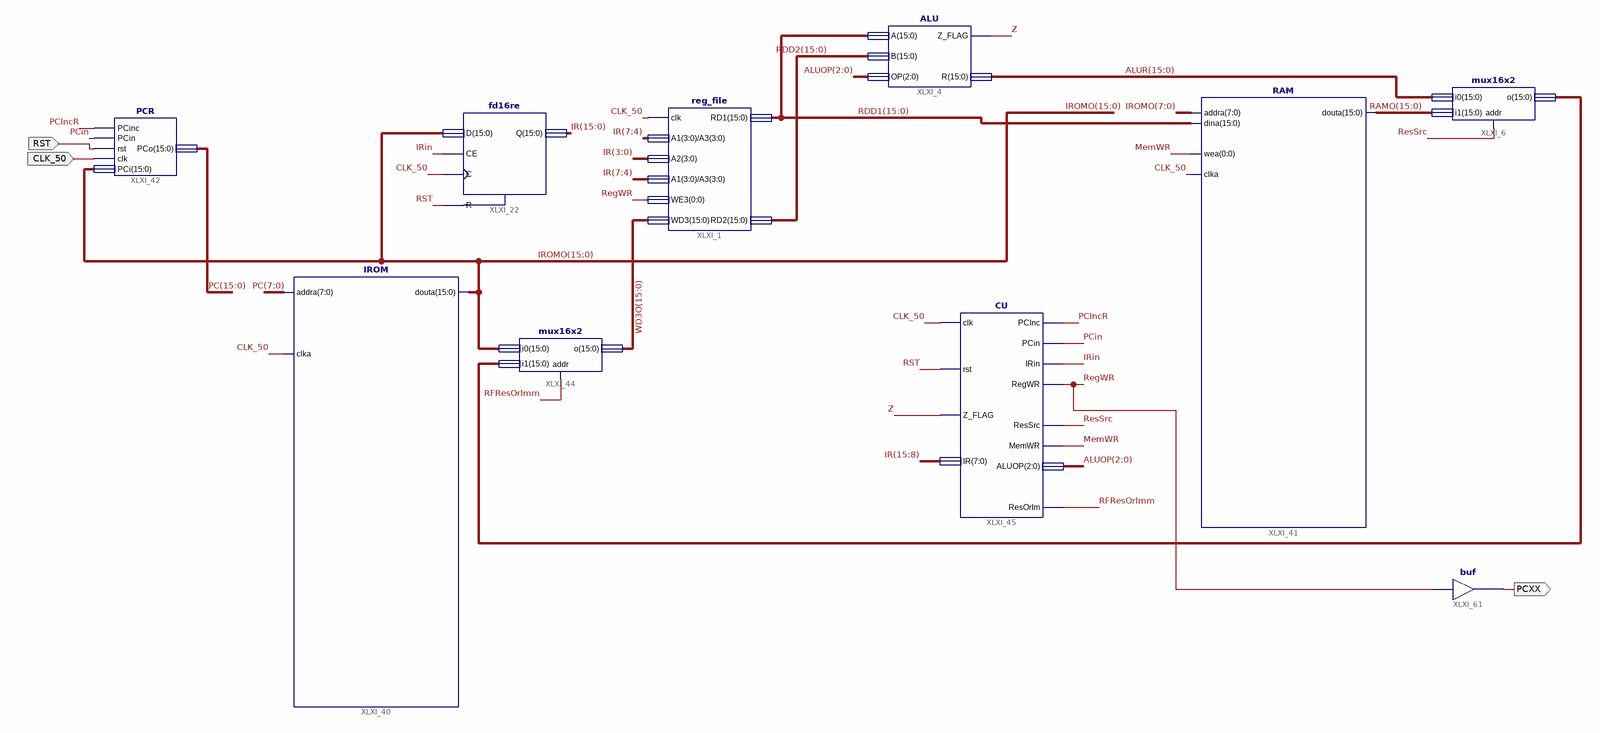
[diagram p0: schematic sheet 1]
// Xilinx ISE schematic cpu.sch (spartan3e) as structural Verilog: 10 symbols, 3 ports
module cpu (
  input  RST,
  input  CLK_50,
  output PCXX
);

  wire IRin, MemWR, PCin, PCIncR, RegWR, ResSrc, RFResOrImm, Z;
  wire [2:0] ALUOP;
  wire [15:0] ALUR, IR, IROMO, PC, RAMO, RDD1, RDD2, WD3O, XLXN_50;

  reg_file XLXI_1 (
    .clk(CLK_50), .A1(IR[7:4]), .A2(IR[3:0]), .A3(IR[7:4]), .WE3(RegWR), .WD3(WD3O), .RD1(RDD1), .RD2(RDD2));
  ALU XLXI_4 (.A(RDD1), .B(RDD2), .OP(ALUOP), .Z_FLAG(Z), .R(ALUR));
  mux16x2 XLXI_6 (.i0(ALUR), .i1(RAMO), .o(XLXN_50), .addr(ResSrc));
  fd16re XLXI_22 (.C(CLK_50), .CE(IRin), .D(IROMO), .R(RST), .Q(IR));
  IROM XLXI_40 (.addra(PC[7:0]), .clka(CLK_50), .douta(IROMO));
  RAM XLXI_41 (.addra(IROMO[7:0]), .dina(RDD1), .wea(MemWR), .clka(CLK_50), .douta(RAMO));
  PCR XLXI_42 (.PCinc(PCIncR), .PCin(PCin), .rst(RST), .clk(CLK_50), .PCi(IROMO), .PCo(PC));
  mux16x2 XLXI_44 (.i0(IROMO), .i1(XLXN_50), .o(WD3O), .addr(RFResOrImm));
  CU XLXI_45 (
    .clk(CLK_50), .rst(RST), .Z_FLAG(Z), .IR(IR[15:8]), .PCInc(PCIncR), .PCin(PCin), .IRin(IRin),
    .RegWR(RegWR), .ResSrc(ResSrc), .ResOrIm(RFResOrImm), .MemWR(MemWR), .ALUOP(ALUOP));
  buf XLXI_61 (PCXX, RegWR);
endmodule
